# Altium schematic sheet Headers.SchDoc
size A
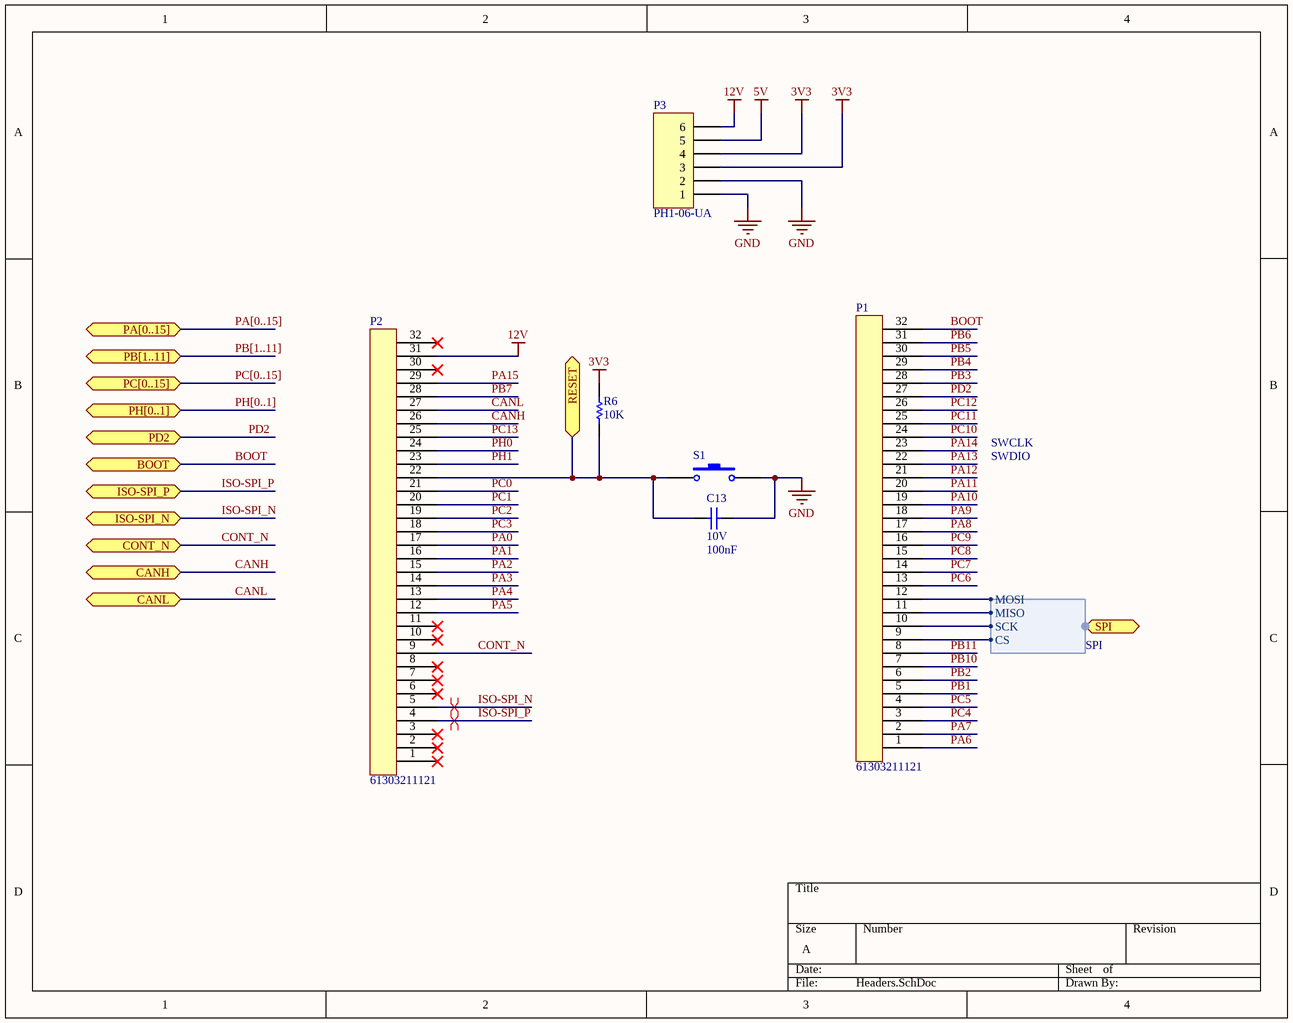
[diagram p0: Headers.SchDoc]

## Parts
C13  10V  value 100nF  [C0805]
P1  61303211121  [61303211121]
P2  61303211121  [61303211121]
P3  PH1-06-UA  [PH1-06-UA]
R6  value 10K  [J1-0603]  (hidden comment: 5%)
S1  PTS636 SM43 SMTR LFS  [PTS636 SM43 SMTR LFS]  (value not drawn)

## Ports
BOOT (bidir), CANH (bidir), CANL (bidir), CONT_N (bidir), ISO-SPI_N (bidir), ISO-SPI_P (bidir), PA[0..15] (bidir), PB[1..11] (bidir), PC[0..15] (bidir), PD2 (bidir), PH[0..1] (bidir), RESET (bidir), SPI (bidir, harness SPI)

## Harnesses
SPI: CS, SCK, MISO, MOSI

## Nets
3V3: P3.3 P3.4 R6.2
5V: P3.5
12V: P2.31 P3.6
GND: C13.2 P3.1 P3.2 S1.2
BOOT: P1.32 ; port BOOT
CANH: P2.26 ; port CANH
CANL: P2.27 ; port CANL
CONT_N: P2.9 ; port CONT_N
ISO-SPI_N: P2.5 ; port ISO-SPI_N
ISO-SPI_P: P2.4 ; port ISO-SPI_P
PA0: P2.17
PA1: P2.16
PA2: P2.15
PA3: P2.14
PA4: P2.13
PA5: P2.12
PA6: P1.1
PA7: P1.2
PA8: P1.17
PA9: P1.18
PA10: P1.19
PA11: P1.20
PA12: P1.21
PA13: P1.22
PA14: P1.23
PA15: P2.29
PB1: P1.5
PB2: P1.6
PB3: P1.28
PB4: P1.29
PB5: P1.30
PB6: P1.31
PB7: P2.28
PB10: P1.7
PB11: P1.8
PC0: P2.21
PC1: P2.20
PC2: P2.19
PC3: P2.18
PC4: P1.3
PC5: P1.4
PC6: P1.13
PC7: P1.14
PC8: P1.15
PC9: P1.16
PC10: P1.24
PC11: P1.25
PC12: P1.26
PC13: P2.25
PD2: P1.27 ; port PD2
PH0: P2.24
PH1: P2.23
RESET: C13.1 P2.22 R6.1 S1.1 ; port RESET
NetP1_9: P1.9 ; port SPI.CS
NetP1_10: P1.10 ; port SPI.SCK
NetP1_11: P1.11 ; port SPI.MISO
NetP1_12: P1.12 ; port SPI.MOSI

Not connected (* = marked no-connect by the designer): P2 1* 2* 3* 6* 7* 8* 10* 11* 30* 32*

## Buses and harness runs
bus PA[0..15] = port PA[0..15]
bus PB[1..11] = port PB[1..11]
bus PC[0..15] = port PC[0..15]
bus PH[0..1] = port PH[0..1]

## Layout directives
differential pair: ISO-SPI_N, ISO-SPI_P

## Notes on the sheet
- SWDIO
- SWCLK

## Library data of the parts
C13 = Cap: C0805C104K8RACTU. 0.1µF ±10% 10V Ceramic Capacitor X7R 0805 (2012 Metric) /; Published: 8-Jun-2000; LatestRevisionDate: 17-Jul-2002; LatestRevisionNote: Re-released for DXP Platform.; PackageReference: RAD-0.3; Publisher: Altium Limited; PackageDescription: Radial Cap, Thru-Hole; 2 Leads; 0.3 in Pin Spacing
P3 = Header 6: Connector Header Through Hole 6 position 0.100" (2.54mm); LatestRevisionDate: 17-Jul-2002; LatestRevisionNote: Re-released for DXP Platform.; Publisher: Altium Limited
R6 = Res1: ERJ-3GEYJ103V. 10 kOhms ±5% 0.1W, 1/10W Chip Resistor 0603 (1608 Metric) Automotive AEC-Q200 Thick Film /; Published: 8-Jun-2000; LatestRevisionDate: 17-Jul-2002; LatestRevisionNote: Re-released for DXP Platform.; PackageReference: AXIAL-0.3; Publisher: Altium Limited; PackageDescription: Axial Device, Thru-Hole; 2 Leads; 0.3 in Pin Spacing
S1 = SW-PB: Tactile Switch SPST-NO Top Actuated Surface Mount; Published: 24-Mar-1999; LatestRevisionDate: 17-Jul-2002; LatestRevisionNote: Re-released for DXP Platform.; PackageReference: SPST-2; Publisher: Altium Limited; PackageDescription: Switch; 2 Leads